# Altium project NC1-3AA.PrjPcb
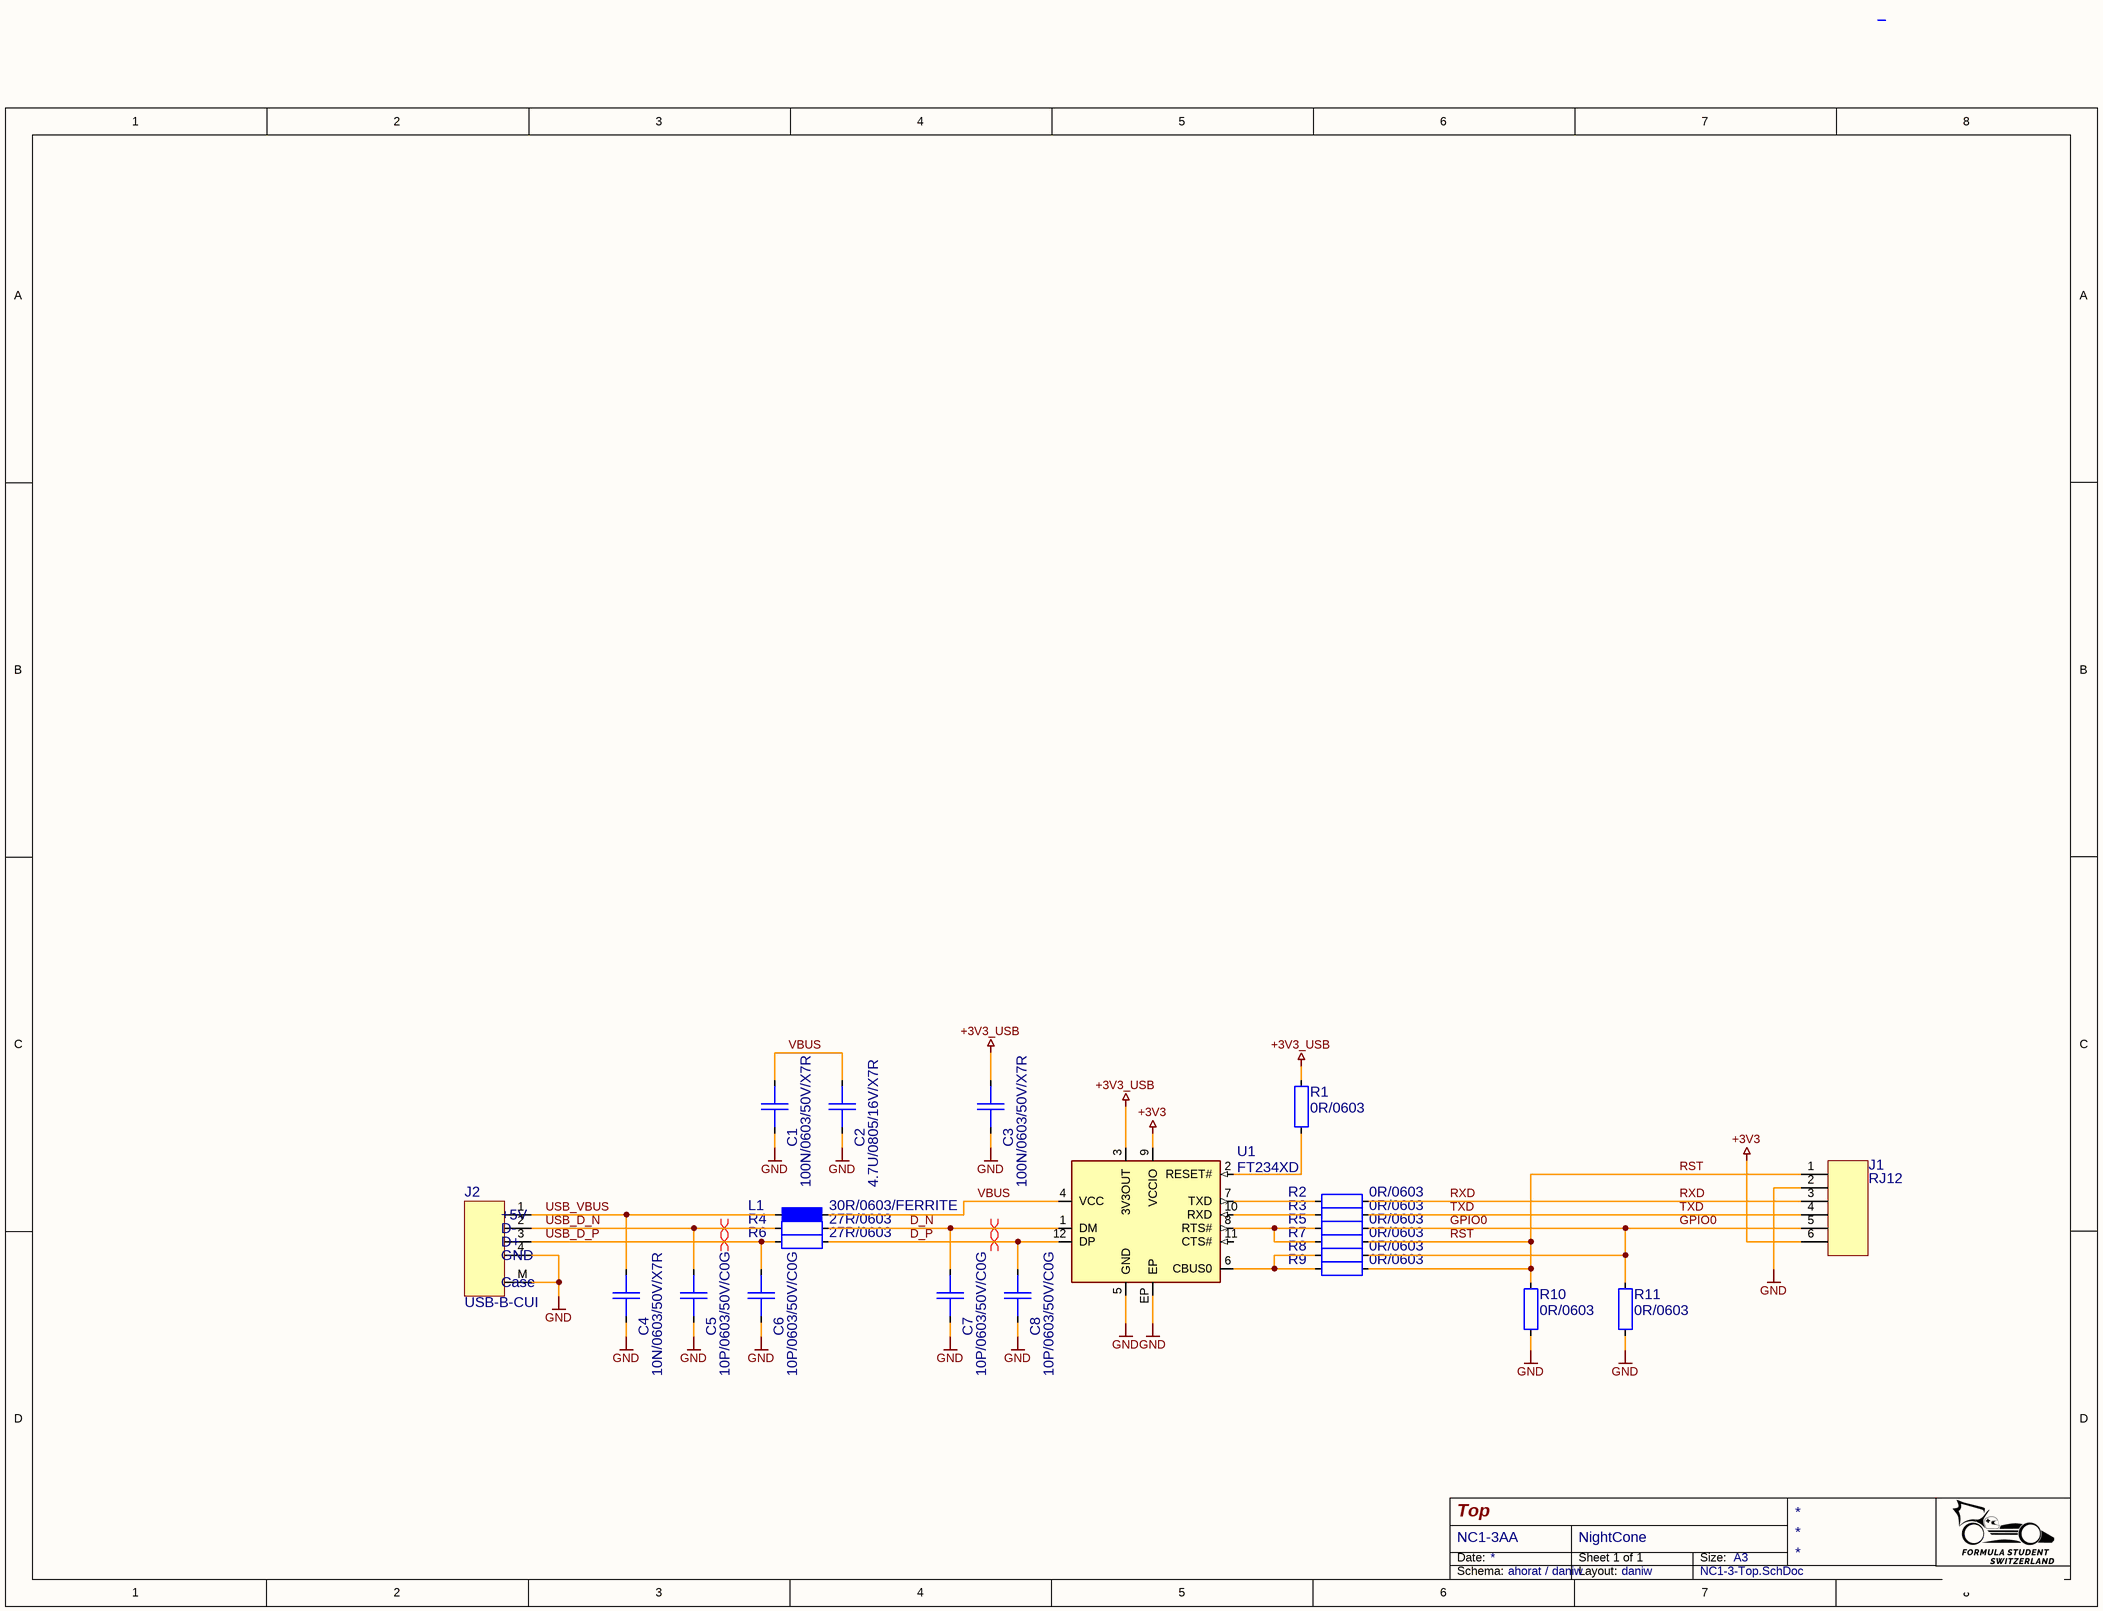
[diagram p0: NC1-3-Top.SchDoc]
Author: ahorat / daniw; Index_Main: A; Index_Sub: A; Layout_Designer: daniw; PCB_NAME: NC1-3; Project: NightCone; Schema_Designer: ahorat / daniw
1 sheet, 23 parts. Net scope: global (net labels, ports and power ports of the same name join across sheets).
Board files: NC1-3A-BASIS.PcbDoc, NC1-3A-PANEL.PcbDoc

## Sheet NC1-3-Top.SchDoc: Top
size A3; SheetNumber: 1; SheetTotal: 1

### Parts
C1  100N/0603/50V/X7R  [CAP0603_X7R]
C2  4.7U/0805/16V/X7R  [CAP0805_X7R]
C3  100N/0603/50V/X7R  [CAP0603_X7R]
C4  10N/0603/50V/X7R  [CAP0603_X7R]
C5  10P/0603/50V/C0G  [CAP0603_C0G]
C6  10P/0603/50V/C0G  [CAP0603_C0G]
C7  10P/0603/50V/C0G  [CAP0603_C0G]
C8  10P/0603/50V/C0G  [CAP0603_C0G]
J1  RJ12  [RJ12-PULSE-E5566-Q0LK22-L]
J2  USB-B-CUI  [USB-B_CUI_UJ2-BH-TH]
L1  30R/0603/FERRITE  [FB0603]
R1  0R/0603  [R0603-0.40-WW]
R2  0R/0603  [R0603-0.40-WW]
R3  0R/0603  [R0603-0.40-WW]
R4  27R/0603  [R0603-0.40-WW]
R5  0R/0603  [R0603-0.40-WW]
R6  27R/0603  [R0603-0.40-WW]
R7  0R/0603  [R0603-0.40-WW]
R8  0R/0603  [R0603-0.40-WW]
R9  0R/0603  [R0603-0.40-WW]
R10  0R/0603  [R0603-0.40-WW]
R11  0R/0603  [R0603-0.40-WW]
U1  FT234XD  [DFN045P300X300X080-12-EP160X250]

### Nets
+3V3: J1.6 U1.9(VCCIO)
+3V3_USB: C3.1 R1.1 U1.3(3V3OUT)
GND: C1.2 C2.2 C3.2 C4.2 C5.2 C6.2 C7.2 C8.2 J1.2 J2.4 J2.M R10.1 R11.1 U1.5(GND) U1.EP
D_N: C7.1 R4.2 U1.1(DM)
D_P: C8.1 R6.2 U1.12(DP)
GPIO0: J1.5 R5.2 R8.2 R11.2
RST: J1.1 R7.2 R9.2 R10.2
RXD: J1.3 R2.2
TXD: J1.4 R3.2
USB_D_N: C5.1 J2.2 R4.1
USB_D_P: C6.1 J2.3 R6.1
USB_VBUS: C4.1 J2.1 L1.1
VBUS: C1.1 C2.1 L1.2 U1.4(VCC)
NetR1_2: R1.2 U1.2(RESET#)
NetR2_1: R2.1 U1.7(TXD)
NetR3_1: R3.1 U1.10(RXD)
NetR5_1: R5.1 R7.1 U1.8(RTS#)
NetR8_1: R8.1 R9.1 U1.6(CBUS0)

Not connected (* = marked no-connect by the designer): U1 11(CTS#)

### Layout directives
differential pair; differential pair class USB; rule Matched Net Lengths [Tolerance = 0.2mm]: D_N, D_P, USB_D_N, USB_D_P

### Notes on the sheet
- Date:
- Size:
- A3
- Schema:
- Layout:
- (in symbol USB-B-CUI) +5V; D-; D+; GND; Case

### Library data of the parts
C1 C3 = 100N/0603/50V/X7R: CAP SM 0603 100nF 50V X7R; Manufacturer: GENERIC; Manufacturer 1: YAGEO; Manufacturer Part Number 1: CC0603KPX7R9BB104; Absolute Value: 1E-7; Eurocircuits GPN: GPC0603104; Part Number: 100N/0603/50V/X7R; Package: 0603; Value: 100nF; HelpURL: https://www.yageo.com/upload/media/product/app/datasheet/mlcc/upy-gphc_x7r_6_3v-to-250v.pdf; Supplier 1: Digi-Key; Supplier Part Number 1: 311-3567-1-ND; Manufacturer 2: YAGEO; Manufacturer Part Number 2: CC0603MRX7R9BB104; Supplier 2: Digi-Key; Supplier Part Number 2: 311-4110-1-ND; Supplier 3: LCSC; Supplier Part Number 3: C14663; JLC Type: Basic
C2 = 4.7U/0805/16V/X7R: CAP SM 0805 4.7uF 16V X7R; Manufacturer: GENERIC; Manufacturer 1: Murata; Manufacturer Part Number 1: GRM21BR71C475KE51L; Absolute Value: 4.7E-6; Eurocircuits GPN: GPN0805475-16; Part Number: 4.7U/0805/16V/X7R; Package: 0805; Value: 4.7uF; HelpURL: https://search.murata.co.jp/Ceramy/image/img/A01X/G101/ENG/GRM21BR71C475KE51-01.pdf; Supplier 1: Digi-Key; Supplier Part Number 1: 490-14466-1-ND; Manufacturer Part Number 3: TCC0603X5R475M160CT; Supplier 3: LCSC; Supplier Part Number 3: C7393897
C4 = 10N/0603/50V/X7R: CAP SM 0603 10nF 50V X7R; Manufacturer: GENERIC; Manufacturer 1: YAGEO; Manufacturer Part Number 1: CC0603KPX7R9BB103; Absolute Value: 1E-8; Eurocircuits GPN: GPC0603103; Part Number: 10N/0603/50V/X7R; Package: 0603; Value: 10nF; HelpURL: https://www.yageo.com/upload/media/product/app/datasheet/mlcc/upy-gphc_x7r_6_3v-to-250v.pdf; Supplier 1: Digi-Key; Supplier Part Number 1: 311-1572-1-ND; Manufacturer 2: YAGEO; Manufacturer Part Number 2: CC0603KRX7R9BB103; Supplier 2: Digi-Key; Supplier Part Number 2: 311-1085-1-ND; Manufacturer Part Number 3: CC0603KRX7R9BB103; Supplier 3: LCSC; Supplier Part Number 3: C100042
C5-C8 = 10P/0603/50V/C0G: CAP SM 0603 10pF 50V C0G; Manufacturer: GENERIC; Manufacturer 1: YAGEO; Manufacturer Part Number 1: CC0603JRNPO9BN100; Absolute Value: 1E-11; Eurocircuits GPN: GPC0603100-C0G; Part Number: 10P/0603/50V/C0G; Package: 0603; Value: 10pF; HelpURL: https://www.yageo.com/upload/media/product/productsearch/datasheet/mlcc/UPY-GP_NP0_16V-to-50V_18.pdf; Supplier 1: Digi-Key; Supplier Part Number 1: 311-1058-1-ND; Manufacturer 2: YAGEO; Manufacturer Part Number 2: CC0603KRNPO9BN100; Supplier 2: Digi-Key; Supplier Part Number 2: 311-4025-1-ND
J1 = RJ12-PULSE-E5566-Q0LK22-L: RJ12 Pulse E5566-Q0LK22-L; Manufacturer 1: Pulse Electronics; Part Number: RJ12-PULSE-E5566-Q0LK22-L; HelpURL: https://productfinder.pulseelectronics.com/api/open/part-attachments/datasheet/E5566-Q0LK22-L; Manufacturer Part Number 1: E5566-Q0LK22-L; Supplier 1: Digi-Key; Supplier Part Number 1: 553-2258-ND; Manufacturer: Pulse
J2 = USB-B-CUI: USB-B CUI UJ2-BH-TH; Manufacturer 1: CUI Devices; Manufacturer Part Number 1: UJ2-BH-1-TH; Part Number: USB-B-CUI; Manufacturer: CUI; HelpURL: https://www.cuidevices.com/product/resource/uj2-bh-th.pdf; Supplier 1: Digi-Key; Supplier Part Number 1: 102-3999-ND
L1 = 30R/0603/FERRITE: 30R@100MHz 5A 0603 Ferrite; Manufacturer: GENERIC; Manufacturer 1: Laird-Signal Integrity Products; Manufacturer Part Number 1: HI0603R300R-10; Value: 30R; Absolute Value: 1000; Part Number: 30R/0603/FERRITE; Package: 603; HelpURL: https://www.laird.com/document/datasheet/hi0603r300r-10-datasheet; Supplier 1: Digi-Key; Supplier Part Number 1: 240-HI0603R300R-10CT-ND
R1-R3 R5 R7-R11 = 0R/0603: RES SM 0603 0R; Manufacturer: GENERIC; Manufacturer 1: YAGEO; Manufacturer Part Number 1: RC0603FR-070RL; Absolute Value: 0; Eurocircuits GPN: GPR06030R; Part Number: 0R/0603; Package: 0603; Value: 0R; HelpURL: https://www.yageo.com/upload/media/product/app/datasheet/rchip/pyu-rc_group_51_rohs_l.pdf; Supplier 1: Digi-Key; Supplier Part Number 1: 311-0.0HRCT-ND; Manufacturer 2: YAGEO; Manufacturer Part Number 2: RC0603FR-130RL; Supplier 2: Digi-Key; Supplier Part Number 2: 13-RC0603FR-130RLCT-ND; Manufacturer 3: UNI-ROYAL(Uniroyal Elec); Manufacturer Part Number 3: 0603WAF0000T5E; Supplier 3: LCSC; Supplier Part Number 3: C21189; JLC Type: Basic
R4 R6 = 27R/0603: RES SM 0603 27R; Manufacturer: GENERIC; Manufacturer 1: YAGEO; Manufacturer Part Number 1: RC0603FR-1327RL; Absolute Value: 27; Eurocircuits GPN: GPR060327R; Part Number: 27R/0603; Package: 0603; Value: 27R; HelpURL: https://www.yageo.com/upload/media/product/productsearch/datasheet/rchip/PYu-RC_Group_51_RoHS_L_12.pdf; Supplier 1: Digi-Key; Supplier Part Number 1: 13-RC0603FR-1327RLCT-ND; Manufacturer 2: YAGEO; Manufacturer Part Number 2: RC0603FR-0727RL; Supplier 2: Digi-Key; Supplier Part Number 2: 311-27.0HRCT-ND
U1 = FT234XD: FT234XD USB TO BASIC UART IC; Manufacturer: FTDI; Manufacturer 1: FTDI, Future Technology Devices International Ltd; Manufacturer Part Number 1: FT234XD-R; Part Number: FT234XD; Package: DFN-12; HelpURL: https://www.ftdichip.com/Support/Documents/DataSheets/ICs/DS_FT234XD.pdf; Supplier 1: Digi-Key; Supplier Part Number 1: 768-1178-1-ND; Manufacturer 2: FTDI, Future Technology Devices International Ltd; Manufacturer Part Number 2: FT234XD-T; Supplier 2: Digi-Key; Supplier Part Number 2: 768-1345-ND